# EasyEDA Pro project ProPrj_STM32数字多用表_2024-12-06.epro

# Schematic Schematic1
Board Name: Board1; Create Date: 2024-10-22; Page Name: P1; Project Name: STM32数字多用表; Schematic Name: Schematic1; Update Date: 2024-11-01; Company: 武汉理工大学; Drawed: 廖钟涛、胡广、聂汝琦; Page Size: A4; Version: V1.0
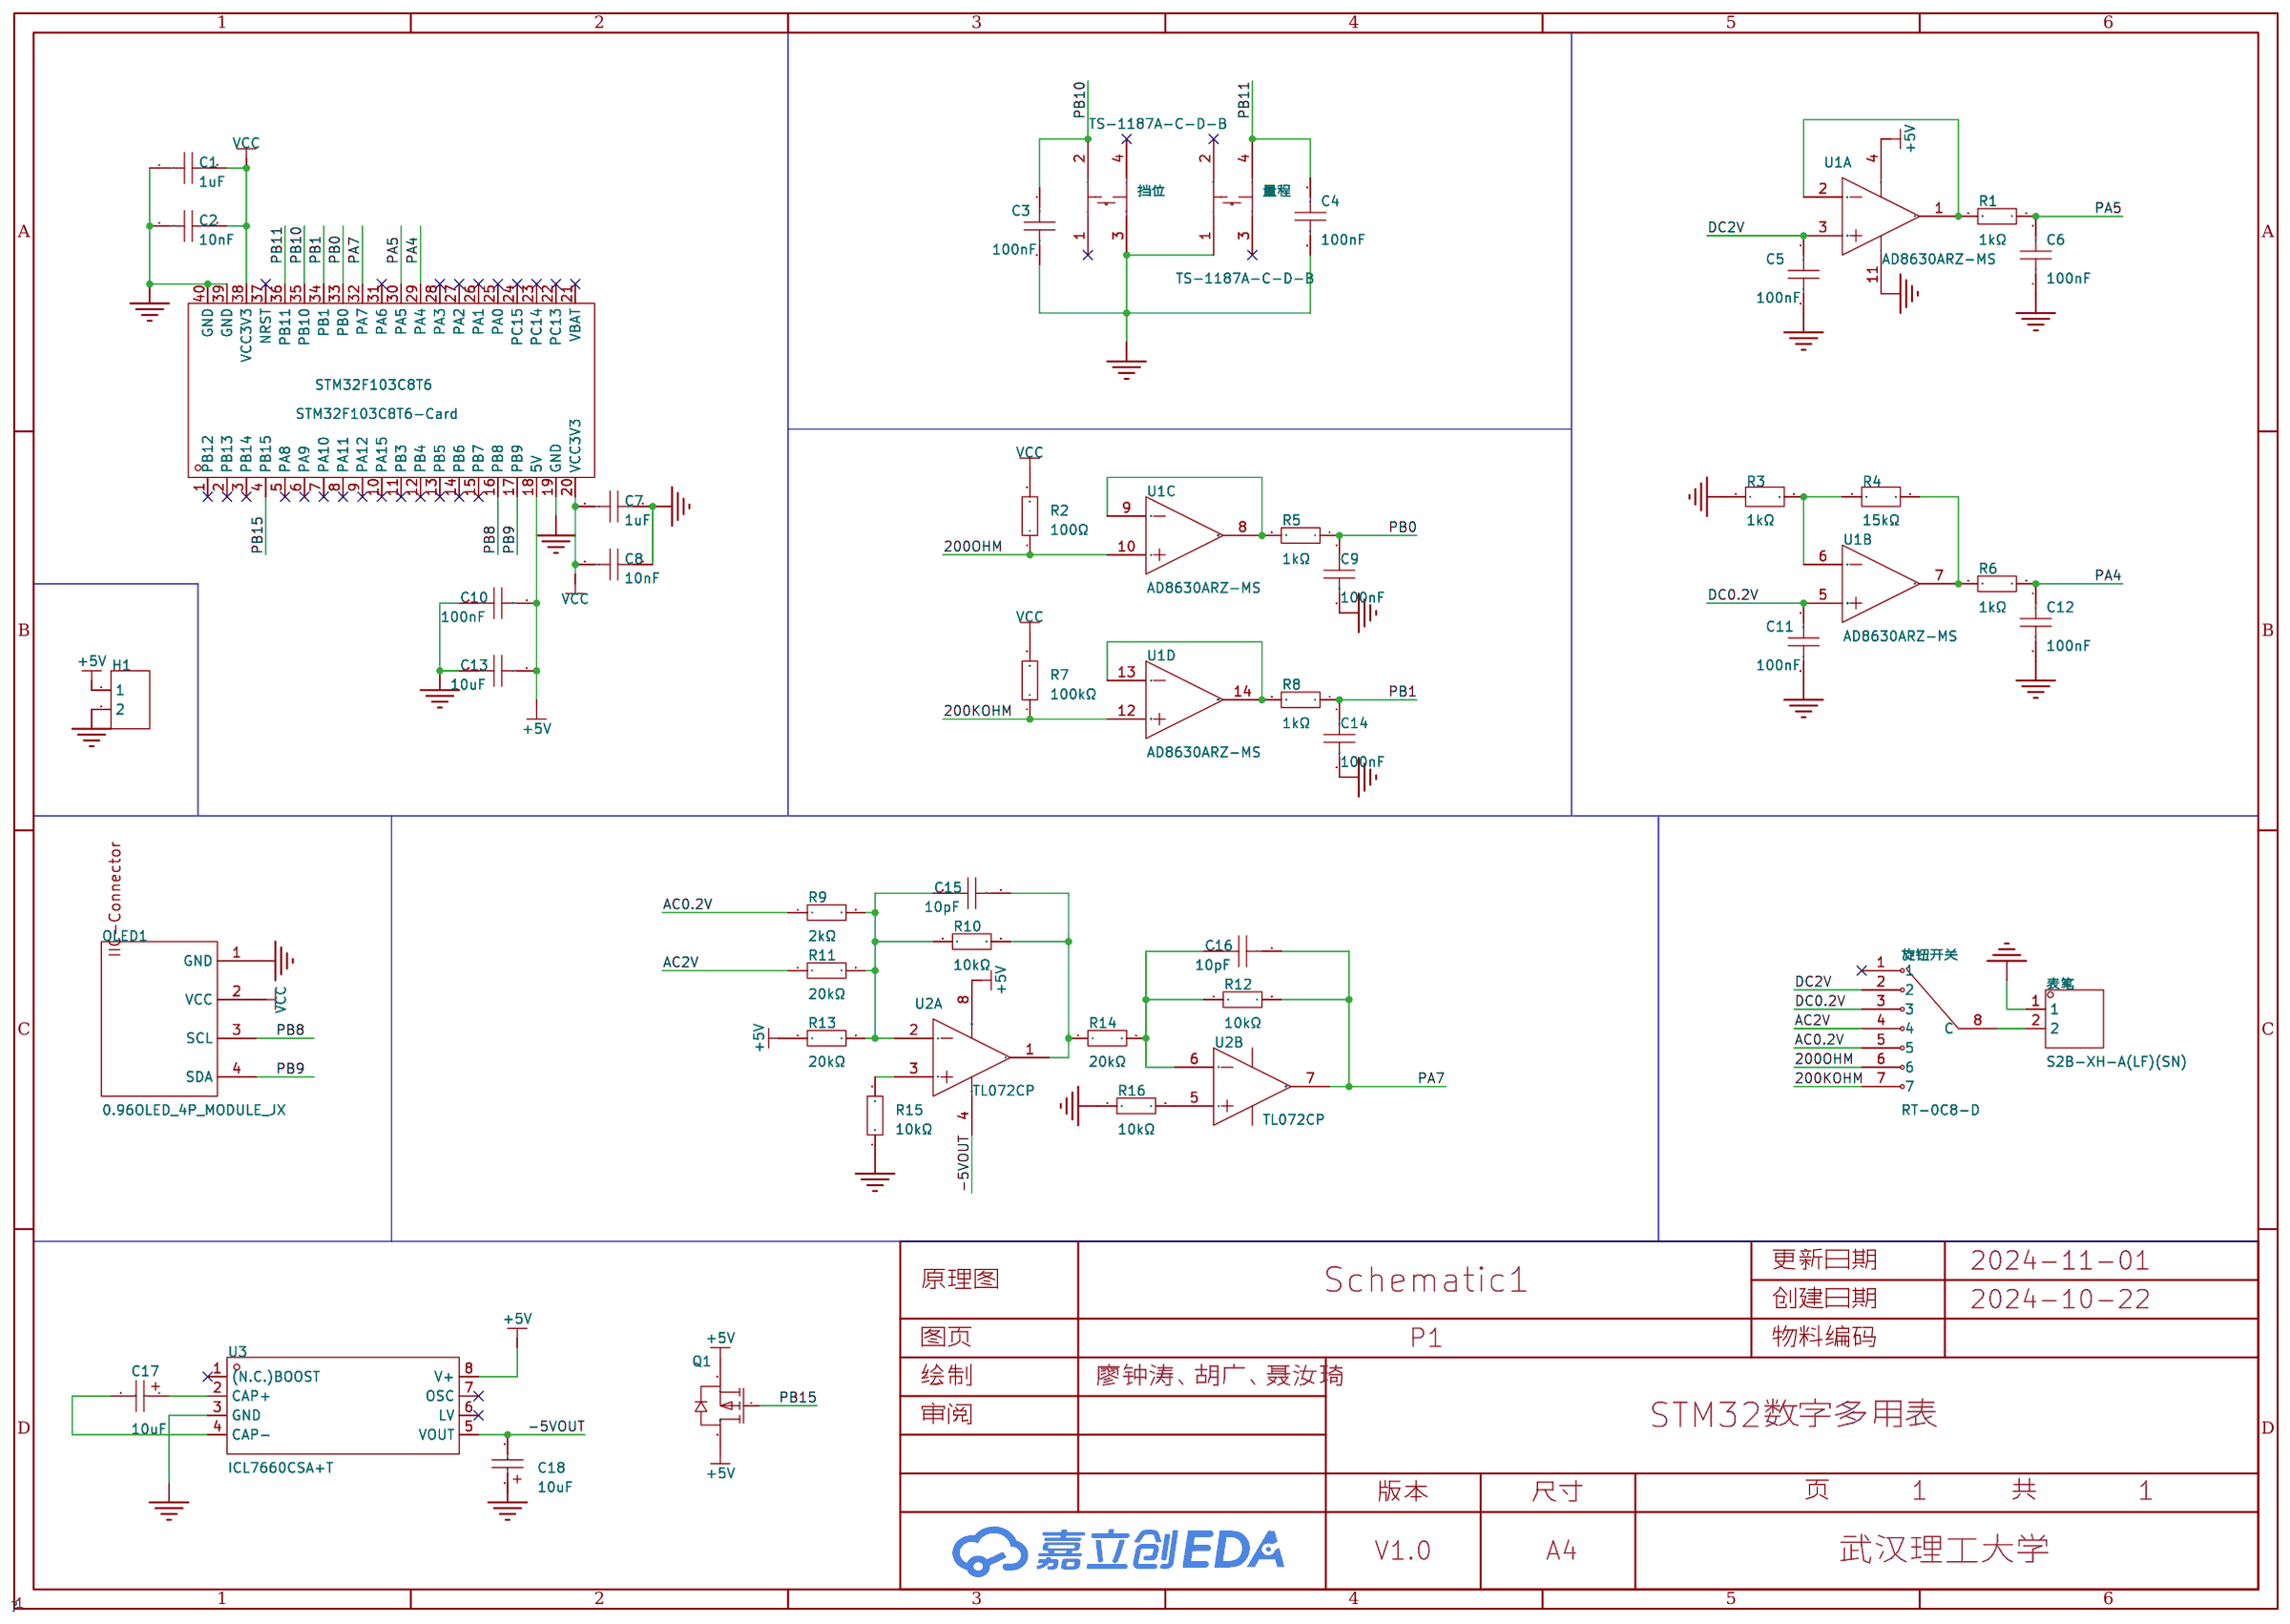
[diagram p0: schematic sheet]

## Parts
C1  1uF  [C0603]
C2  10nF  [C0603]
C3  100nF  [C0603]
C4  100nF  [C0603]
C5  100nF  [C0603]
C6  100nF  [C0603]
C7  1uF  [C0603]
C8  10nF  [C0603]
C9  100nF  [C0603]
C10  100nF  [C0603]
C11  100nF  [C0603]
C12  100nF  [C0603]
C13  10uF  [C0603]
C14  100nF  [C0603]
C15  10pF  [C0603]
C16  10pF  [C0603]
C17  10uF  [CAP-SMD_L3.2-W1.6-RD-C7171]
C18  10uF  [CAP-SMD_L3.2-W1.6-RD-C7171]
H1  -  [HDR-TH_2P-P2.54-V-F]
OLED1  0.96OLED_4P_MODULE_JX  [0.96OLED_4P]
Q1  JMTL3401A  [SOT-23-3_L2.9-W1.3-P1.90-LS2.4-BR]
R1  1kΩ  [R0603]
R2  100Ω  [R0603]
R3  1kΩ  [R0603]
R4  15kΩ  [R0603]
R5  1kΩ  [R0603]
R6  1kΩ  [R0603]
R7  100kΩ  [R0603]
R8  1kΩ  [R0603]
R9  2kΩ  [R0603]
R10  10kΩ  [R0603]
R11  20kΩ  [R0603]
R12  10kΩ  [R0603]
R13  20kΩ  [R0603]
R14  20kΩ  [R0603]
R15  10kΩ  [R0603]
R16  10kΩ  [R0603]
STM32F103C8T6  STM32F103C8T6-Card  [CONN-TH_L53.3-W22.9_STM32F103C8T6-CARD]
U1  AD8630ARZ-MS  [SOIC-14_L8.7-W3.9-P1.27-LS6.0-BL]  (sections 1,2,3,4)
U2  TL072CP  [DIP-8_L9.6-W6.4-P2.54-LS7.6-BL-1]  (sections 1,2)
U3  ICL7660CSA+T  [SO-8_L4.9-W3.9-P1.27-LS5.9-BL]
挡位  TS-1187A-C-D-B  [KEY-SMD_4P-L5.2-W5.2-P3.7-LS6.4-TL]
旋钮开关  RT-0C8-D  [SW-TH_RT-0C4-D]
表笔  S2B-XH-A(LF)(SN)  [CONN-TH_S2B-XH-A-LF-SN]
量程  TS-1187A-C-D-B  [KEY-SMD_4P-L5.2-W5.2-P3.7-LS6.4-TL]

## Library data of the parts
C1 C7 = CGA3E3X5R1E105K080AB: 容值:1uF;精度:±10%;额定电压:25V;材质(温度系数):X5R;; LCSC Part Name: 1uF ±10% 25V; Supplier Part: C2183379; Manufacturer: TDK; Supplier Footprint: 0603; JLCPCB Part Class: 扩展库; Datasheet: https://atta.szlcsc.com/upload/public/pdf/source/20210430/BD8671736ED62E65BA506F30C3AAED50.pdf; Supplier: LCSC; Tolerance: ±10%; Voltage Rated: 25V; Temperature Coefficient: X5R
C2 C8 = CGA3E2X8R2A103K080AE: 容值:10nF;精度:±10%;额定电压:100V;材质(温度系数):X8R;; LCSC Part Name: 10nF ±10% 100V; Supplier Part: C2182499; Manufacturer: TDK; Supplier Footprint: 0603; JLCPCB Part Class: 扩展库; Datasheet: https://atta.szlcsc.com/upload/public/pdf/source/20210430/C200C31AE2B660F751EAC3ACFC19C1F0.pdf; Supplier: LCSC; Tolerance: ±10%; Voltage Rated: 100V; Temperature Coefficient: X8R
C3-C6 C9-C12 C14 = CGA3E2X8R1E104M080AD: 容值:100nF;精度:±20%;额定电压:25V;材质(温度系数):X8R;; LCSC Part Name: 100nF ±20% 25V; Supplier Part: C2177182; Manufacturer: TDK; Supplier Footprint: 0603; JLCPCB Part Class: 扩展库; Datasheet: https://atta.szlcsc.com/upload/public/pdf/source/20210427/4892FA4C59E7E6B03D1B6D7A54E21E17.pdf; Supplier: LCSC; Tolerance: ±20%; Voltage Rated: 25V; Temperature Coefficient: X8R
C13 = CGA3E3X7T0G106M080AB: 容值:10uF;精度:±20%;额定电压:4V;材质(温度系数):X7T;; LCSC Part Name: 10uF ±20% 4V; Supplier Part: C3906091; Manufacturer: TDK; Supplier Footprint: 0603; JLCPCB Part Class: 扩展库; Datasheet: https://atta.szlcsc.com/upload/public/pdf/source/20221212/8CC8E75235799FCBADCCB1AB2750F0E4.pdf; Supplier: LCSC; Tolerance: ±20%; Voltage Rated: 4V; Temperature Coefficient: X7T
C15 C16 = CL10C100JB8NNNC: 容值:10pF;精度:±5%;额定电压:50V;材质(温度系数):C0G;; LCSC Part Name: 10pF ±5% 50V; Supplier Part: C1634; Manufacturer: SAMSUNG(三星); Supplier Footprint: 0603; JLCPCB Part Class: Basic Part; Datasheet: https://atta.szlcsc.com/upload/public/pdf/source/20160218/1457707763339.pdf; Supplier: LCSC; Tolerance: ±5%; Voltage Rated: 50V; Temperature Coefficient: C0G
C17 C18 = TAJA106K016RNJ: 容值:10uF;精度:±10%;额定电压:16V;等效串联电阻:3Ω@100kHz;; LCSC Part Name: 10uF ±10% 16V; Supplier Part: C7171; Manufacturer: Kyocera AVX; Supplier Footprint: CASE-A-3216; JLCPCB Part Class: 基础库; Datasheet: https://atta.szlcsc.com/upload/public/pdf/source/20160107/1457707750344.pdf; Supplier: LCSC; Tolerance: ±10%; Rated Voltage: 16V; Equivalent Series Resistance(ESR): 3Ω@100kHz; Operating Temperature: -55℃~+125℃
H1 = HDR-F_2.54_1x2P: Supplier Part: C49661; Supplier Footprint: 插件
OLED1 = 0.96OLED_4P_MODULE_JX: Supplier Part: C9900004566; Supplier Footprint: 插件; JLCPCB Part Class: 扩展库; Supplier: LCSC
Q1 = JMTL3401A: 类型:P沟道;漏源电压(Vdss):30V;连续漏极电流(Id):4.2A;功率(Pd):1.2W;导通电阻(RDS(on)@Vgs,Id):55mΩ@10V,4.2A;阈值电压(Vgs(th)@Id):1.3V@250A;; LCSC Part Name: P沟道 30V 4.2A; Supplier Part: C394037; Manufacturer: JJW(捷捷微); Supplier Footprint: SOT-23; JLCPCB Part Class: Extended Part; Datasheet: https://atta.szlcsc.com/upload/public/pdf/source/20190520/C394037_1B1F4399ADA96748EB0D3E7B8C1E9AF9.pdf; Supplier: LCSC; Type: P沟道; Drain Source Voltage (Vdss): 30V; Continuous Drain Current (Id): 4.2A; Power Dissipation (Pd): 1.2W; Drain Source On Resistance (RDS(on)@Vgs,Id): 55mΩ@10V,4.2A; Gate Threshold Voltage (Vgs(th)@Id): 1.3V@250A
R1 R5 R6 R8 = 0603WAF1001T5E: 电阻类型:厚膜电阻;阻值:1kΩ;精度:±1%;功率:100mW;最大工作电压:75V;温度系数:±100ppm/℃;; LCSC Part Name: 1kΩ ±1% 100mW 厚膜电阻; Supplier Part: C21190; Manufacturer: UNI-ROYAL(厚声); Supplier Footprint: 0603; JLCPCB Part Class: 基础库; Datasheet: https://atta.szlcsc.com/upload/public/pdf/source/20200306/C422600_1E6D84923E4A46A82E41ADD87F860B5C.pdf; Supplier: LCSC; Type: 厚膜电阻; Tolerance: ±1%; Power(Watts): 100mW; Overload Voltage (Max): 75V; Temperature Coefficient: ±100ppm/℃; Operating Temperature Range: -55℃~+155℃
R2 = RMC06031005%N: 阻值:100Ω;精度:±5%;功率:100mW;; LCSC Part Name: 100Ω ±5% 100mW; Supplier Part: C269683; Manufacturer: Tyohm(幸亚电阻); Supplier Footprint: 0603; JLCPCB Part Class: 扩展库; Datasheet: https://atta.szlcsc.com/upload/public/pdf/source/20190115/C325956_D27151D492FFB3C9AB4A6F14FE01F30A.pdf; Supplier: LCSC; Tolerance: ±5%; Power(Watts): 100mW
R3 = TNPW06031K00BEEA: 电阻类型:薄膜电阻;阻值:1kΩ;精度:±0.1%;功率:125mW;最大工作电压:75V;温度系数:±25ppm/℃;; LCSC Part Name: 薄膜电阻 1kΩ ±0.1% 125mW; Supplier Part: C844891; Manufacturer: VISHAY(威世); Supplier Footprint: 0603; JLCPCB Part Class: 扩展库; Datasheet: https://atta.szlcsc.com/upload/public/pdf/source/20201222/C844891_A262B6C3C739D20D6E453E3A09DCF252.pdf; Supplier: LCSC; Type: 薄膜电阻; Tolerance: ±0.1%; Power(Watts): 125mW; Overload Voltage (Max): 75V; Temperature Coefficient: ±25ppm/℃; Operating Temperature Range: -55℃~+155℃
R4 = CRCW060315K0JNEA: 电阻类型:厚膜电阻;阻值:15kΩ;精度:±5%;功率:100mW;最大工作电压:75V;温度系数:±200ppm/℃;; LCSC Part Name: 厚膜电阻 15kΩ ±5% 100mW; Supplier Part: C844326; Manufacturer: VISHAY(威世); Supplier Footprint: 0603; JLCPCB Part Class: 扩展库; Datasheet: https://atta.szlcsc.com/upload/public/pdf/source/20200922/C242478_0C7172CD6F5C3D507069694ED76193BB.pdf; Supplier: LCSC; Type: 厚膜电阻; Tolerance: ±5%; Power(Watts): 100mW; Overload Voltage (Max): 75V; Temperature Coefficient: ±200ppm/℃; Operating Temperature Range: -55℃~+155℃
R7 = 0603WAF1003T5E: 电阻类型:厚膜电阻;阻值:100kΩ;精度:±1%;功率:100mW;最大工作电压:75V;温度系数:±100ppm/℃;; LCSC Part Name: 100kΩ ±1% 100mW 厚膜电阻; Supplier Part: C25803; Manufacturer: UNI-ROYAL(厚声); Supplier Footprint: 0603; JLCPCB Part Class: Basic Part; Datasheet: https://atta.szlcsc.com/upload/public/pdf/source/20200306/C422600_1E6D84923E4A46A82E41ADD87F860B5C.pdf; Supplier: LCSC; Type: 厚膜电阻; Tolerance: ±1%; Power(Watts): 100mW; Overload Voltage (Max): 75V; Temperature Coefficient: ±100ppm/℃; Operating Temperature Range: -55℃~+155℃
R9 = 0603WAF2001T5E: 电阻类型:厚膜电阻;阻值:2kΩ;精度:±1%;功率:100mW;最大工作电压:75V;温度系数:±100ppm/℃;; LCSC Part Name: 2kΩ ±1% 100mW 厚膜电阻; Supplier Part: C22975; Manufacturer: UNI-ROYAL(厚声); Supplier Footprint: 0603; JLCPCB Part Class: Basic Part; Datasheet: https://atta.szlcsc.com/upload/public/pdf/source/20200306/C422600_1E6D84923E4A46A82E41ADD87F860B5C.pdf; Supplier: LCSC; Type: 厚膜电阻; Tolerance: ±1%; Power(Watts): 100mW; Overload Voltage (Max): 75V; Temperature Coefficient: ±100ppm/℃; Operating Temperature Range: -55℃~+155℃
R10 R12 R15 R16 = 0603WAF1002T5E: 电阻类型:厚膜电阻;阻值:10kΩ;精度:±1%;功率:100mW;最大工作电压:75V;温度系数:±100ppm/℃;; LCSC Part Name: 厚膜电阻 10kΩ ±1% 100mW; Supplier Part: C25804; Manufacturer: UNI-ROYAL(厚声); Supplier Footprint: 0603; JLCPCB Part Class: Basic Part; Datasheet: https://atta.szlcsc.com/upload/public/pdf/source/20200306/C422600_1E6D84923E4A46A82E41ADD87F860B5C.pdf; Supplier: LCSC; Type: 厚膜电阻; Tolerance: ±1%; Power(Watts): 100mW; Overload Voltage (Max): 75V; Temperature Coefficient: ±100ppm/℃; Operating Temperature Range: -55℃~+155℃
R11 R13 R14 = 0603WAF2002T5E: 电阻类型:厚膜电阻;阻值:20kΩ;精度:±1%;功率:100mW;最大工作电压:75V;温度系数:±100ppm/℃;; LCSC Part Name: 20kΩ ±1% 100mW 厚膜电阻; Supplier Part: C4184; Manufacturer: UNI-ROYAL(厚声); Supplier Footprint: 0603; JLCPCB Part Class: Basic Part; Datasheet: https://atta.szlcsc.com/upload/public/pdf/source/20200306/C422600_1E6D84923E4A46A82E41ADD87F860B5C.pdf; Supplier: LCSC; Type: 厚膜电阻; Tolerance: ±1%; Power(Watts): 100mW; Overload Voltage (Max): 75V; Temperature Coefficient: ±100ppm/℃; Operating Temperature Range: -55℃~+155℃
STM32F103C8T6 = STM32F103C8T6-Card: Supplier Part: C9900077949; Supplier Footprint: 插件; Supplier: LCSC
U1 = AD8630ARZ-MS: 此款零漂移四通道运放，采用SOP14封装，他的工作电压2-5.5V,带宽6MHZ,偏移电压0.03µV,输入补偿电压2uV，静态电流600uA,其特点高性能、低功耗的出色表现，能够广泛应用于消费电子产品，音频设备，仪器仪表讯设备以及任何需要精密信号放大的场合，是你的PCB设计最佳选择。; Supplier Part: C22462542; Manufacturer: MSKSEMI(美森科); Supplier Footprint: SOP-14; JLCPCB Part Class: 扩展库; Datasheet: https://atta.szlcsc.com/upload/public/pdf/source/20240618/7B2869656343ADFE631E520B59A27983.pdf; Supplier: LCSC
U2 = TL072CP: 运放类型:J-FET;放大器组数:2;增益带宽积（GBP）:3MHz;压摆率（SR）:13 V/us;电源电压:7V~36V,±3.5V~18V;各通道供电电流:1.4mA;; Supplier Part: C7236; Manufacturer: TI(德州仪器); Supplier Footprint: DIP-8; JLCPCB Part Class: Extended Part; Datasheet: https://atta.szlcsc.com/upload/public/pdf/source/20140704/1457707129967.pdf; Supplier: LCSC; Amplifier Type: J-FET; Number of Circuits: 2; Gain Bandwidth Product（GBP）: 3MHz; Slew Rate（SR）: 13 V/us; Supply Voltage（Single）: 7V~36V,±3.5V~18V; Iq per channel (Typ): 1.4mA; Operating Temperature: 0°C ~ 70°C
U3 = ICL7660CSA+T: 开关电容电压转换器、20mA电荷泵，采用工业标准引脚排列; Supplier Part: C596400; Manufacturer: ADI(亚德诺)/MAXIM(美信); Supplier Footprint: SO-8; JLCPCB Part Class: 扩展库; Datasheet: https://atta.szlcsc.com/upload/public/pdf/source/20191209/C407899_F02514FE12C1148958261B7B463B7B63.pdf; Supplier: LCSC
挡位 量程 = TS-1187A-C-D-B: 电路结构:单刀单掷;按钮形状:圆形按钮;作用力:260gf;安装方式:立贴;开关长度:5.1mm;开关宽度:5.1mm;开关高度:2mm;带支架:不带;触点电流:50mA;额定电压(DC):12V;绝缘电阻:-;带灯:无;机械寿命:10万次;; LCSC Part Name: 5.1*5.1*2mm 立贴 轻触开关; Supplier Part: C318888; Manufacturer: XKB Connectivity(中国星坤); Supplier Footprint: SMD; JLCPCB Part Class: 扩展库; Datasheet: https://atta.szlcsc.com/upload/public/pdf/source/20211011/CF465E46D2427DB66E133733EF19F823.pdf; Supplier: LCSC; Circuit: 单刀单掷; Actuator Style: 圆形按钮; Operating Force: 260gf; Mounting Style: 立贴; Switch Length: 5.1mm; Switch Width: 5.1mm; Switch Height: 2mm; Strike Gundam: 不带; Contact Current: 50mA; Voltage Rating (DC): 12V; Actuator/Cap Color: 金色; With Lamp: 无; Mechanical Life: 10万次; Operating Temperature: -30℃~+85℃
旋钮开关 = RT-0C8-D: 带灯:-;接点数:-;触点类型:-;额定电流:500mA;额定电压(AC):-;额定电压(DC):24V;切换角度:-;层数:-;每层极数:-;; LCSC Part Name: RT系列旋钮开关短柄; Supplier Part: C508444; Manufacturer: Dailywell(德利威); Supplier Footprint: 插件; Datasheet: https://atta.szlcsc.com/upload/public/pdf/source/20200407/C508444_348EF37BAA01A3E81FFFA52EE3C3045F.pdf; Supplier: LCSC; Actuator Type: 扁平型(带槽); Termination Style: PC引脚; Mechanical Life: 2千次; Contact Current: 500mA; Voltage Rating (DC): 24V; Operating Temp: -20℃~+70℃
表笔 = S2B-XH-A(LF)(SN): 插针结构:1x2P;间距:2.5mm;安装方式:弯插;参考系列:XH;总PIN数:2P;排数:1;每排PIN数:2;行距:-;额定电流:3A;触头材质:黄铜;触头镀层:锡;工作温度范围:-25℃~+85℃;; LCSC Part Name: 1x2P 间距:2.5mm 弯插 系列:XH; Supplier Part: C157931; Manufacturer: JST; Supplier Footprint: 弯插,P=2.5mm; JLCPCB Part Class: Extended Part; Datasheet: https://atta.szlcsc.com/upload/public/pdf/source/20180928/C265283_F9DFEEBDB2CF642B6BDFAB4B77BD2680.pdf; Supplier: LCSC; Pins Structure: 1x2P; Pitch: 2.5mm; Mounting Style: 弯插; Reference Series: XH; Number of Pins: 2P; Number of Rows: 1; Number of PINs Per Row: 2; Current Rating (Max): 3A; Contact Material: 黄铜; Contact Plating: 锡; Operating Temperature Range: -25℃~+85℃; Rated Voltage (Max): 250V; Plastic Material: PA66; Flame Retardant Rating: UL94V-0; Supplementary Features: 打K脚; Colour: 白色; Z-Height of the Board: 6.1mm; X-Length of Bottom Edge on Board (Spacing Line): 7.4mm; Y-Width of Bottom Edge on Board: 11.5mm

## Nets
+5V: C10.2 C13.1 H1.1 Q1.2(S) Q1.3(D) R13.1 STM32F103C8T6.18(5V) U1.4(V+) U2.8(VCC+) U3.8(V+)
-5VOUT: C18.2 U2.4(VCC-) U3.5(VOUT)
GND: C1.1 C2.1 C3.2 C4.2 C5.2 C6.1 C7.2 C8.2 C9.2 C10.1 C11.2 C12.2 C13.2 C14.2 C18.1 H1.2 OLED1.1(GND) R3.1 R15.1 R16.1 STM32F103C8T6.19(GND) STM32F103C8T6.39(GND) STM32F103C8T6.40(GND) U1.11(V-) U3.3(GND) 挡位.3 表笔.1 量程.1
VCC: C1.2 C2.2 C7.1 C8.1 OLED1.2(VCC) R2.2 R7.2 STM32F103C8T6.20(VCC3V3) STM32F103C8T6.38(VCC3V3)
200KOHM: R7.1 U1.12(+IN D) 旋钮开关.7
200OHM: R2.1 U1.10(+IN C) 旋钮开关.6
AC0.2V: R9.1 旋钮开关.5
AC2V: R11.1 旋钮开关.4
DC0.2V: C11.1 U1.5(+IN B) 旋钮开关.3
DC2V: C5.1 U1.3(+IN A) 旋钮开关.2
PA4: C12.1 R6.2 STM32F103C8T6.29(PA4)
PA5: C6.2 R1.1 STM32F103C8T6.30(PA5)
PA7: C16.2 R12.2 STM32F103C8T6.32(PA7) U2.7(OUT2)
PB0: C9.1 R5.1 STM32F103C8T6.33(PB0)
PB1: C14.1 R8.1 STM32F103C8T6.34(PB1)
PB8: OLED1.3(SCL) STM32F103C8T6.16(PB8)
PB9: OLED1.4(SDA) STM32F103C8T6.17(PB9)
PB10: C3.1 STM32F103C8T6.35(PB10) 挡位.2
PB11: C4.1 STM32F103C8T6.36(PB11) 量程.4
PB15: Q1.1(G) STM32F103C8T6.4(PB15)
$1N6231: C15.1 R9.2 R10.1 R11.2 R13.2 U2.2(IN1-)
$1N6233: R15.2 U2.3(IN1+)
$1N6489: C15.2 R10.2 R14.1 U2.1(OUT1)
$1N6498: C16.1 R12.1 R14.2 U2.6(IN2-)
$1N25115: R1.2 U1.1(OUTA) U1.2(–IN A)
$1N27258: R16.2 U2.5(IN2+)
$1N27573: R4.2 R6.1 U1.7(OUTB)
$1N27580: R3.2 R4.1 U1.6(–IN B)
$1N27743: R5.2 U1.8(OUTC) U1.9(–IN C)
$1N27788: R8.2 U1.13(–IN D) U1.14(OUTD)
$1N40919: 旋钮开关.8(C) 表笔.2
$1N44928: C17.1 U3.2(CAP+)
$1N44932: C17.2 U3.4(CAP-)

Not connected (* = marked no-connect by the designer): STM32F103C8T6 1(PB12)* 2(PB13)* 3(PB14)* 5(PA8)* 6(PA9)* 7(PA10)* 8(PA11)* 9(PA12)* 10(PA15)* 11(PB3)* 12(PB4)* 13(PB5)* 14(PB6)* 15(PB7)* 21(VBAT)* 22(PC13)* 23(PC14)* 24(PC15)* 25(PA0)* 26(PA1)* 27(PA2)* 28(PA3)* 31(PA6)* 37(NRST)*; U3 1((N.C.)BOOST)* 6(LV)* 7(OSC)*; 挡位 1* 4*; 旋钮开关 1*; 量程 2* 3*

# Board PCB1
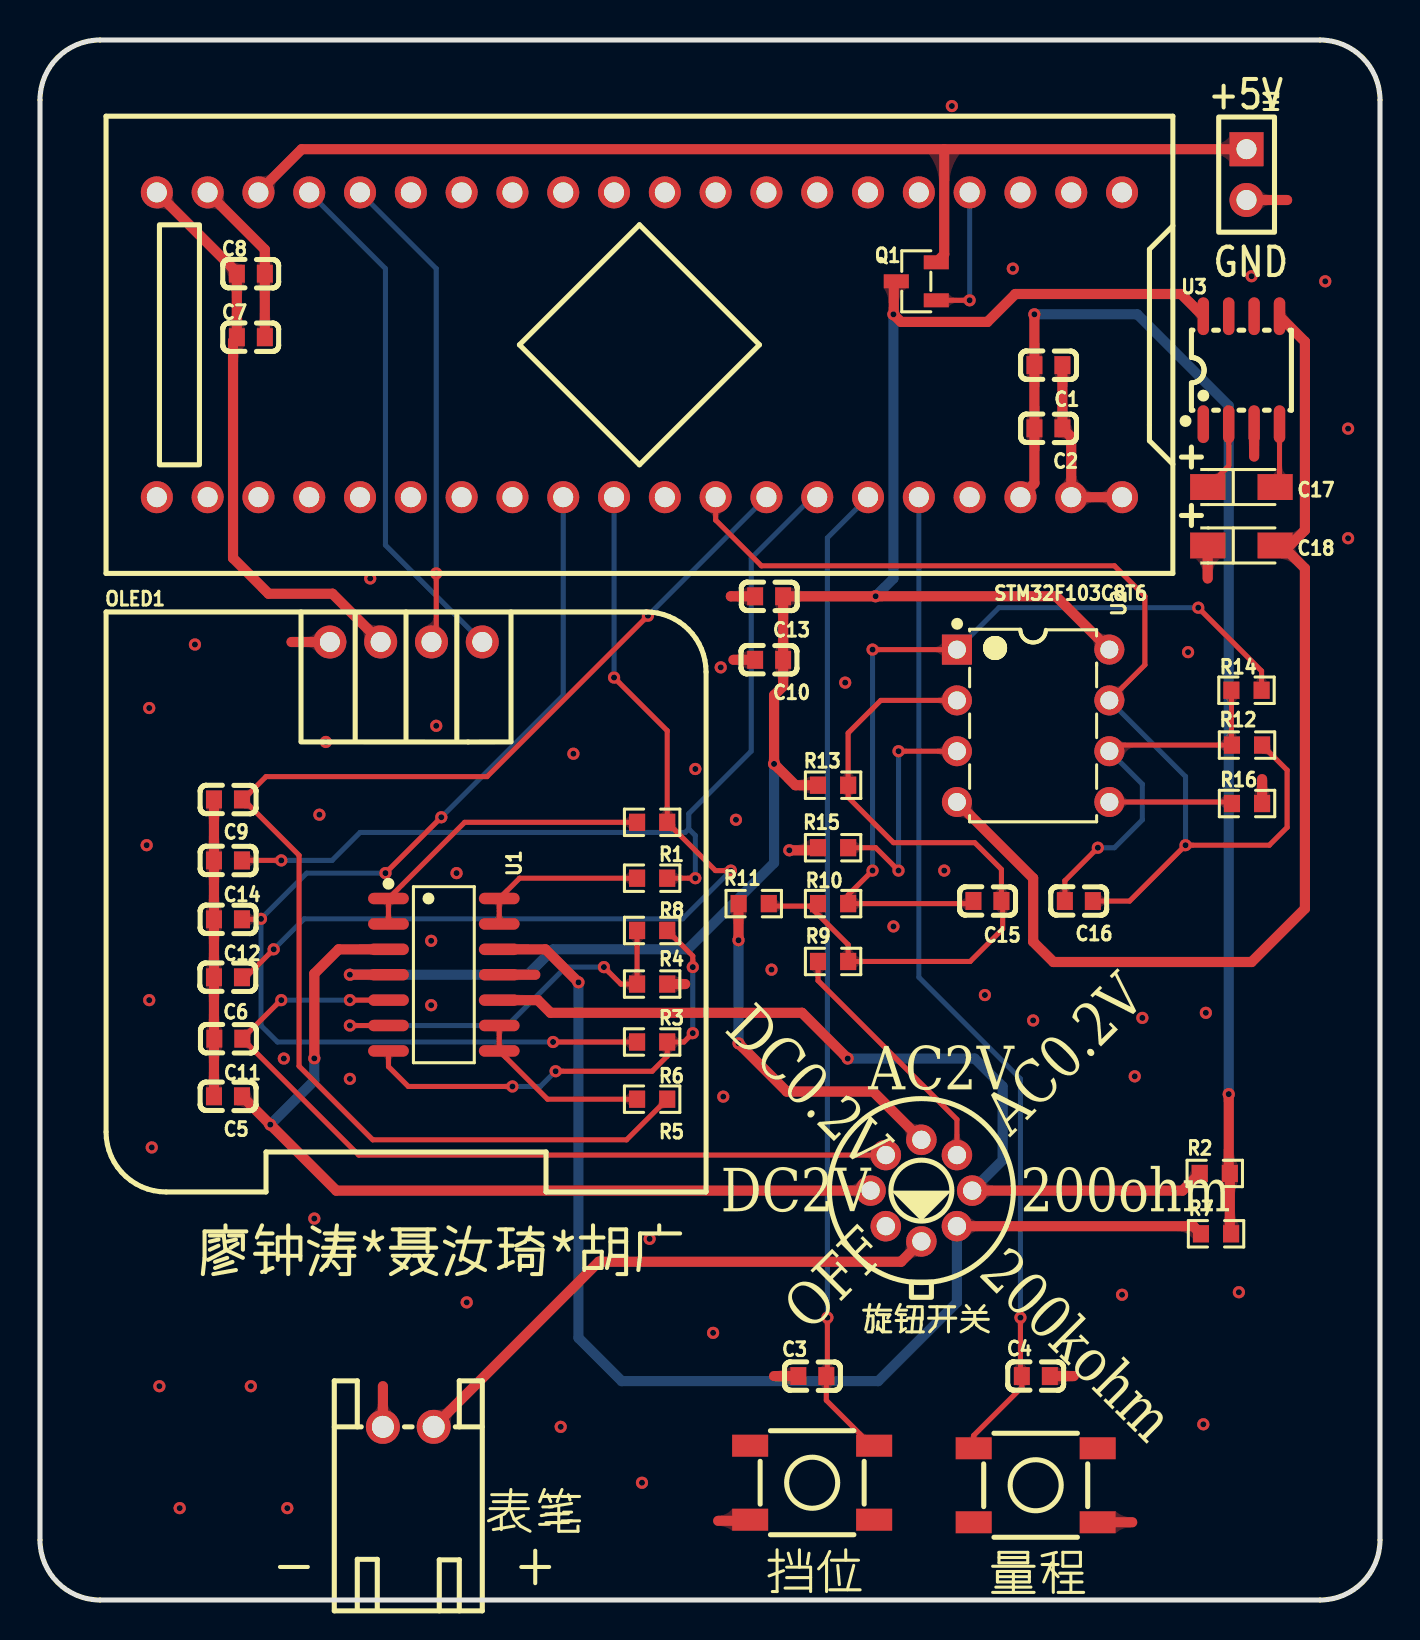
[diagram p1: board, top side]
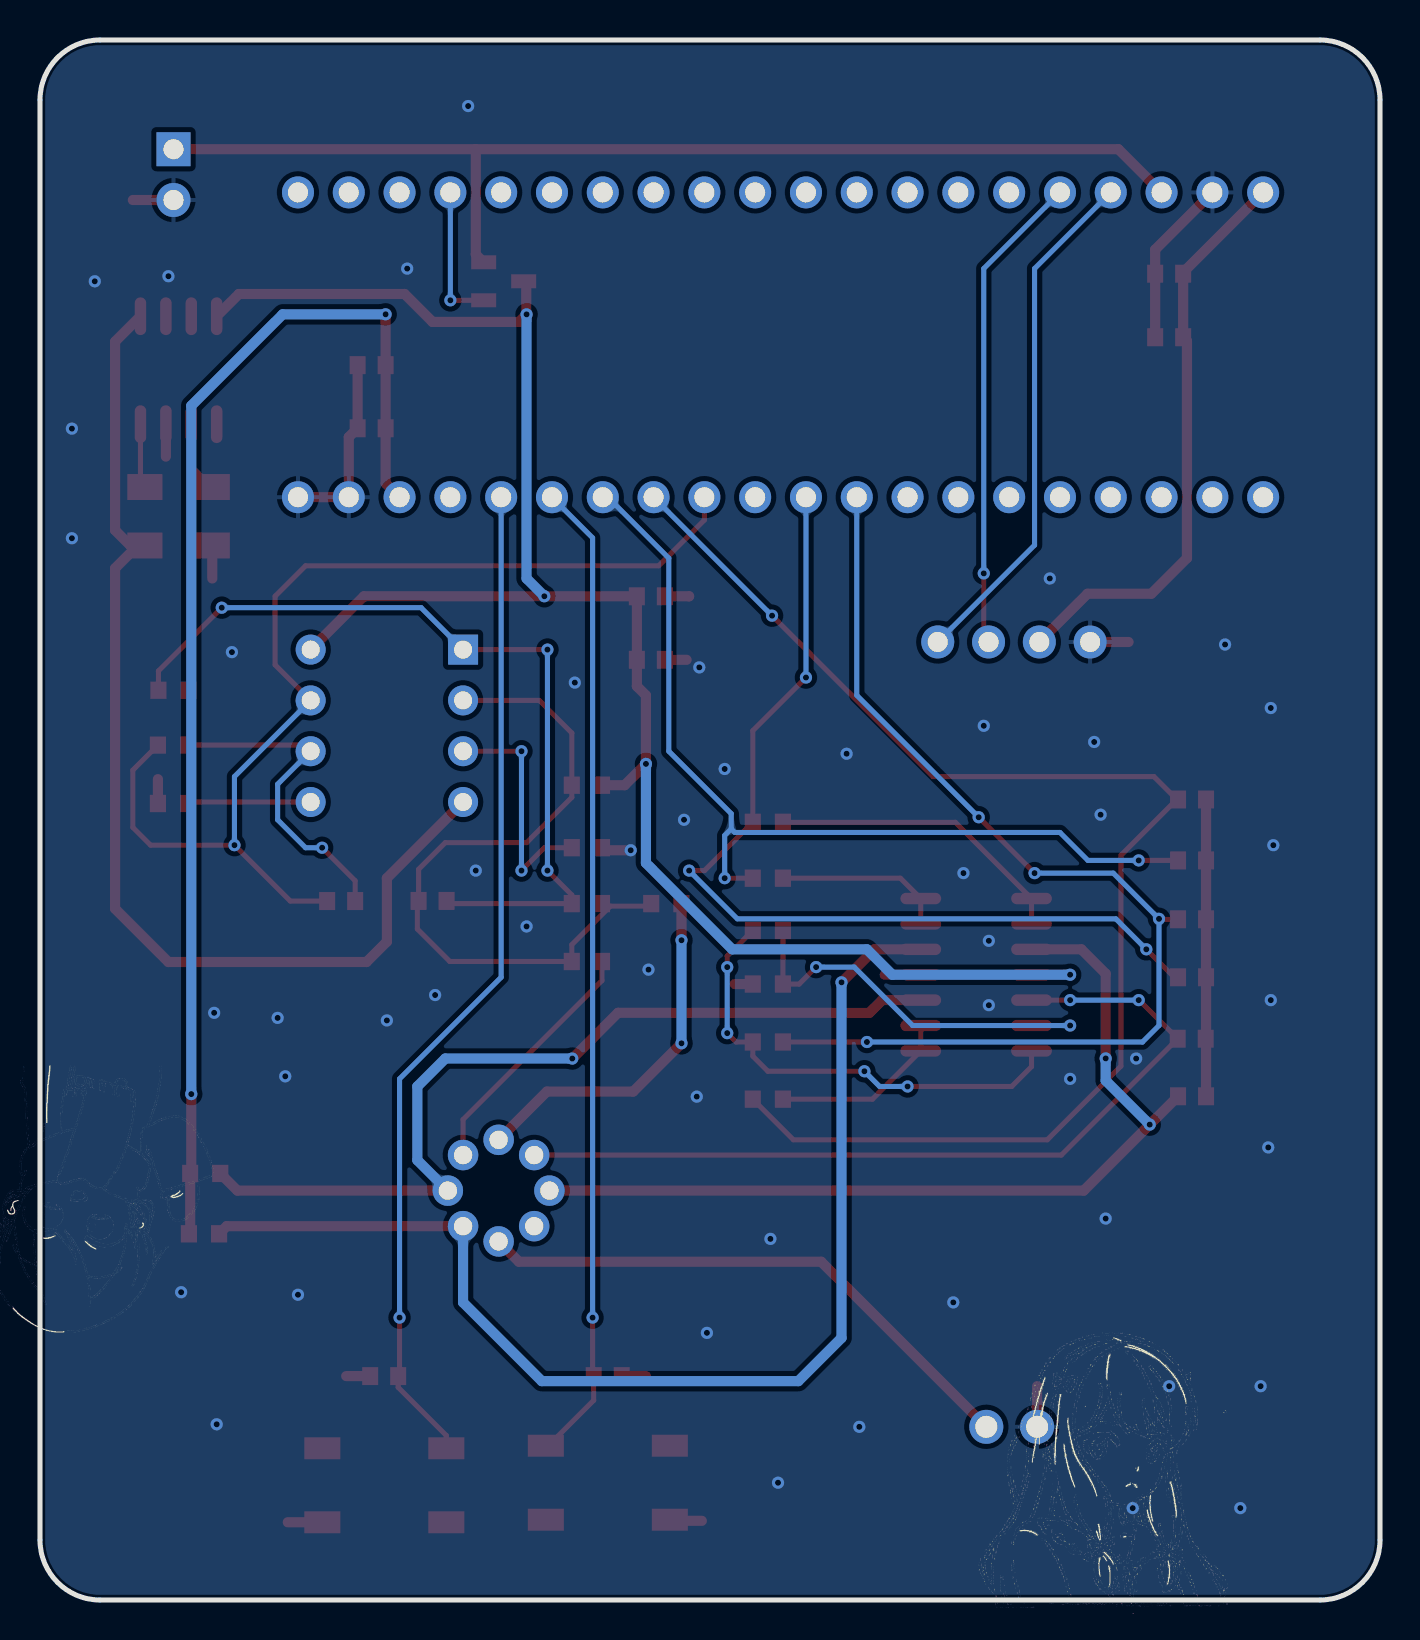
[diagram p2: board, bottom side, seen from below]

Outline 67 x 78 mm; copper layers: Top Layer, Bottom Layer. Coordinates in mm from the lower left corner of the outline.
Outline path: 0,75 0,3 arc(0.88,0.88) 3,0 64,0 arc(66.12,0.88) 67,3 67,75 arc(66.12,77.12) 64,78 3,78 arc(0.88,77.12) 0,75
Stack: Top Layer 0.035mm / Dielectric1 1.51mm FR4 er 4.5 / Bottom Layer 0.035mm

## Design rules (mm)
net GND: power
net VCC: power
net +5V: power
net AC2V: power
net 200KOHM: power
net DC2V: power
net -5VOUT: power
template: 自定义配置
spacing copperThickness1oz (default): track to track 0.203, other pairs 0.203 to 0.203
spacing copperThickness2oz: track to track 0.203, other pairs 0.152 to 0.3
track width copperThickness1oz (default): min 0.152, default 0.254, max 0.508
track width copperThickness2oz: min 0.203, default 0.254, max 2.54
track width power: min 0.305, default 0.508, max 2.54
differential pair differentialPair (default): width min 0.152, default 0.152, max 0.152; gap min 0.152, default 0.152
via viaSize (default): diameter min 0.61, default 0.61, max 0.61; hole min 0.305, default 0.305, max 0.305
net class power uses power
net GND uses power
net VCC uses power
net +5V uses power
net AC2V uses power
net 200KOHM uses power
net DC2V uses power
net 200OHM uses power
net -5VOUT uses power

## Placement (name value [footprint] x y rotation side)
C1  1uF  [C0603]  50.42 61.74 180 top
C2  10nF  [C0603]  50.42 58.59 180 top
C3  100nF  [C0603]  38.62 11.2 180 top
C4  100nF  [C0603]  49.79 11.2 0 top
C5  100nF  [C0603]  9.4 25.19 180 top
C6  100nF  [C0603]  9.4 31.14 0 top
C7  1uF  [C0603]  10.54 63.14 0 top
C8  10nF  [C0603]  10.54 66.31 0 top
C9  100nF  [C0603]  9.4 40.03 180 top
C10  100nF  [C0603]  36.46 47.01 0 top
C11  100nF  [C0603]  9.41 28.07 180 top
C12  100nF  [C0603]  9.4 34.03 180 top
C13  10uF  [C0603]  36.46 50.18 180 top
C14  100nF  [C0603]  9.4 36.98 180 top
C15  10pF  [C0603]  47.37 34.95 180 top
C16  10pF  [C0603]  51.94 34.95 0 top
C17  10uF  [CAP-SMD_L3.2-W1.6-RD-C7171]  60.07 55.65 0 top
C18  10uF  [CAP-SMD_L3.2-W1.6-RD-C7171]  60.07 52.73 0 top
H1  -  [HDR-TH_2P-P2.54-V-F]  60.32 71.27 270 top
OLED1  0.96OLED_4P_MODULE_JX  [0.96OLED_4P]  18.3 47.9 0 top
Q1  JMTL3401A  [SOT-23-3_L2.9-W1.3-P1.90-LS2.4-BR]  43.81 65.94 0 top
R1  1kΩ  [R0603]  30.61 38.88 180 top
R2  100Ω  [R0603]  58.74 21.33 0 top
R3  1kΩ  [R0603]  30.61 30.8 180 top
R4  15kΩ  [R0603]  30.61 33.48 0 top
R5  1kΩ  [R0603]  30.61 25.04 180 top
R6  1kΩ  [R0603]  30.61 27.9 180 top
R7  100kΩ  [R0603]  58.8 18.31 0 top
R8  1kΩ  [R0603]  30.61 36.09 180 top
R9  2kΩ  [R0603]  39.65 31.93 0 top
R10  10kΩ  [R0603]  39.65 34.82 0 top
R11  20kΩ  [R0603]  35.69 34.82 0 top
R12  10kΩ  [R0603]  60.35 42.75 0 top
R13  20kΩ  [R0603]  39.65 40.74 0 top
R14  20kΩ  [R0603]  60.32 45.49 180 top
R15  10kΩ  [R0603]  39.65 37.61 0 top
R16  10kΩ  [R0603]  60.35 39.82 180 top
STM32F103C8T6  STM32F103C8T6-Card  [CONN-TH_L53.3-W22.9_STM32F103C8T6-CARD]  29.97 62.76 180 top
U1  AD8630ARZ-MS  [SOIC-14_L8.7-W3.9-P1.27-LS6.0-BL]  20.19 31.26 270 top
U2  TL072CP  [DIP-8_L9.6-W6.4-P2.54-LS7.6-BL-1]  49.66 43.71 270 top
U3  ICL7660CSA+T  [SO-8_L4.9-W3.9-P1.27-LS5.9-BL]  60.07 61.49 0 top
挡位  TS-1187A-C-D-B  [KEY-SMD_4P-L5.2-W5.2-P3.7-LS6.4-TL]  38.61 5.86 0 top
旋钮开关  RT-0C8-D  [SW-TH_RT-0C4-D]  44.07 20.47 180 top
表笔  S2B-XH-A(LF)(SN)  [CONN-TH_S2B-XH-A-LF-SN]  18.41 8.66 180 top
量程  TS-1187A-C-D-B  [KEY-SMD_4P-L5.2-W5.2-P3.7-LS6.4-TL]  49.78 5.74 180 top

## Footprints (pads in the part's own frame, mm; a bottom-side part is the same pattern mirrored in y, then rotated)
0.96OLED_4P
  round 1.65 hole 1: 1(-3.81,-0.002) 2(-1.27,0.002) 3(1.27,0.002) 4(3.81,0.002)
C0603
  rect 0.8x0.9 smd: 1(-0.7,0) 2(0.7,0)
CAP-SMD_L3.2-W1.6-RD-C7171
  rect 1.758x1.296 smd: 1(-1.687,0) 2(1.687,0)
CONN-TH_L53.3-W22.9_STM32F103C8T6-CARD
  round 1.6 hole 1: 1(-24.13,-7.62) 2(-21.59,-7.62) 3(-19.05,-7.62) 4(-16.51,-7.62) 5(-13.97,-7.62) 6(-11.43,-7.62) 7(-8.89,-7.62) 8(-6.35,-7.62) 9(-3.81,-7.62) 10(-1.27,-7.62) 11(1.27,-7.62) 12(3.81,-7.62) 13(6.35,-7.62) 14(8.89,-7.62) 15(11.43,-7.62) 16(13.97,-7.62) 17(16.51,-7.62) 18(19.05,-7.62) 19(21.59,-7.62) 20(24.13,-7.62) 21(24.13,7.62) 22(21.59,7.62) 23(19.05,7.62) 24(16.51,7.62) 25(13.97,7.62) 26(11.43,7.62) 27(8.89,7.62) 28(6.35,7.62) 29(3.81,7.62) 30(1.27,7.62) 31(-1.27,7.62) 32(-3.81,7.62) 33(-6.35,7.62) 34(-8.89,7.62) 35(-11.43,7.62) 36(-13.97,7.62) 37(-16.51,7.62) 38(-19.05,7.62) 39(-21.59,7.62) 40(-24.13,7.62)
CONN-TH_S2B-XH-A-LF-SN
  round 1.7 hole 1.1: 1(1.27,0) 2(-1.27,0)
DIP-8_L9.6-W6.4-P2.54-LS7.6-BL-1
  rect 1.501x1.501 hole 0.899: 1(-3.81,-3.81)
  round 1.501 hole 0.899: 2(-1.27,-3.81) 3(1.27,-3.81) 4(3.81,-3.81) 5(3.81,3.81) 6(1.27,3.81) 7(-1.27,3.81) 8(-3.81,3.81)
HDR-TH_2P-P2.54-V-F
  rect 1.7x1.7 hole 1: 1(-1.27,0)
  round 1.7 hole 1: 2(1.27,0)
KEY-SMD_4P-L5.2-W5.2-P3.7-LS6.4-TL
  rect 1.8x1.1 smd: 1(-3.1,1.85) 2(3.1,1.85) 3(-3.1,-1.85) 4(3.1,-1.85)
R0603
  rect 0.806x0.864 smd: 1(-0.753,0) 2(0.753,0)
SO-8_L4.9-W3.9-P1.27-LS5.9-BL
  oval 0.574x1.888 smd: 1(-1.905,-2.699) 2(-0.635,-2.699) 3(0.635,-2.699) 4(1.905,-2.699) 5(1.905,2.699) 6(0.635,2.699) 7(-0.635,2.699) 8(-1.905,2.699)
SOIC-14_L8.7-W3.9-P1.27-LS6.0-BL
  oval 0.574x2.038 smd: 1(-3.81,-2.769) 2(-2.54,-2.769) 3(-1.27,-2.769) 4(0,-2.769) 5(1.27,-2.769) 6(2.54,-2.769) 7(3.81,-2.769) 8(3.81,2.769) 9(2.54,2.769) 10(1.27,2.769) 11(0,2.769) 12(-1.27,2.769) 13(-2.54,2.769) 14(-3.81,2.769)
SOT-23-3_L2.9-W1.3-P1.90-LS2.4-BR
  rect 1.25x0.7 smd: 1(1,-0.95) 2(1,0.95) 3(-1,0)
SW-TH_RT-0C4-D
  round 1.524 hole 0.914: 1(1.778,1.778) 2(2.54,0) 3(1.778,-1.778) 4(0,-2.54) 5(-1.778,-1.778) 6(-2.54,0) 7(-1.778,1.778) 8(0,2.54)

## Nets
As in the schematic.

Pads without a net: STM32F103C8T6 1 2 3 5 6 7 8 9 10 11 12 13 14 15 21 22 23 24 25 26 27 28 31 37; U3 1 6 7; 挡位 1 4; 旋钮开关 1; 量程 2 3

## Via types
v1: diameter 0.61, hole 0.305, Top Layer to Bottom Layer, 90 vias

## Routing (per net, layer and track width the routed paths; a pad name or vN(x,y) marks a point on that pad's centre or on a via; arc(x,y) is an arc through that point)
+5V: length 148
  Top Layer w0.508: U3.8 57.06,65.3 48.77,65.3 47.37,63.9 43.05,63.9 v1(42.67,64.28) 42.69,64.3 42.69,65.94 ; U1.4 v1(15.49,31.26) ; H1.1 45.21,72.54 ; 45.21,72.54 45.21,67.28 Q1.2 ; 45.21,72.54 13.08,72.54 STM32F103C8T6.18 ; 38.9,40.74 37.77,40.74 v1(36.7,41.81) 36.7,45.23 37.16,45.69 C10.2 C13.1 41.78,50.18 v1(41.78,50.19) 50.8,50.19 U2.8
  Bottom Layer w0.508: v1(41.78,50.19) 42.67,51.08 v1(42.67,64.28) ; v1(36.7,41.81) 36.7,36.85 32.38,32.53 25.65,32.53 24.38,31.26 v1(15.49,31.26)
-5VOUT: length 55.3
  Top Layer w0.508: 62.1,52.73 C18.2 ; 62.1,52.73 62.48,52.73 63.25,53.49 63.25,62.92 U3.5 ; 62.1,52.73 63.25,51.58 63.25,34.57 60.58,31.9 50.67,31.9 49.66,32.92 49.66,36.09 U2.4
GND: length 55.3
  Top Layer w0.508: 表笔.1 17.14,10.69 ; C4.2 51.69,11.2 ; C3.2 36.7,11.2 ; R3.1 32.26,30.8 ; STM32F103C8T6.40 STM32F103C8T6.39 51.56,58.14 C2.1 C1.1 ; R16.1 61.1,41.04 ; 量程.1 54.61,3.89 ; C7.2 C8.2 11.24,67.52 STM32F103C8T6.19 ; U3.3 60.71,57.17 ; C10.1 34.67,47.01 ; C5.2 C6.1 C12.2 C14.2 C9.2 ; v1(37.47,37.49) 38.77,37.49 38.9,37.61 ; OLED1.1 12.57,47.9 ; 34.54,50.19 34.55,50.18 C13.2 ; U1.11 24.76,31.26 ; C18.1 58.38,51.08 ; 挡位.3 35.45,3.96 33.91,3.96 ; H1.2 62.36,70
  vias: v1(5.33,37.74) v1(5.46,44.6) v1(5.46,29.99) v1(5.59,22.63) v1(5.97,10.69) v1(6.98,4.59) v1(7.75,47.77) v1(10.54,10.69) v1(12.19,27.07) v1(12.36,4.59) v1(13.72,19.07) v1(13.97,39.27) v1(14.29,42.9) v1(15.49,26.06) v1(16.51,51.08) v1(19.56,32.96) v1(19.56,29.74) v1(19.81,43.71) v1(20.83,36.34) v1(21.34,14.88) v1(26.03,8.66) v1(26.67,42.31) v1(30.1,5.86) v1(30.48,18.06) v1(32.77,41.55) v1(33.66,13.36) v1(34.04,46.63) v1(34.16,25.17) v1(34.8,39.01) v1(36.58,31.52) v1(40.26,45.87) v1(42.67,33.68) v1(45.21,36.47) v1(45.59,74.7) v1(47.24,30.25) v1(48.64,66.57) v1(49.66,28.98) v1(54.1,15.26) v1(54.74,26.18) v1(55.12,29.11) v1(57.4,47.39) v1(58.17,8.78) v1(58.29,29.36) v1(59.94,15.39) v1(60.58,66.19) v1(64.26,65.94) v1(65.41,58.57) v1(65.41,53.09)
VCC: length 91.6
  Top Layer w0.508: v1(49.72,64.28) C1.2 C2.2 49.72,55.84 STM32F103C8T6.38 ; OLED1.2 14.62,50.31 11.43,50.31 9.65,52.09 9.65,62.95 C7.1 C8.1 9.84,66.38 STM32F103C8T6.20 ; R7.2 59.49,18.37 R2.2 ; v1(59.44,25.3) 59.44,21.38
  Bottom Layer w0.508: v1(49.72,64.28) 54.86,64.28 59.44,59.71 v1(59.44,25.3)
200KOHM: length 60
  Top Layer w0.508: 45.85,18.69 57.67,18.69 R7.1 ; v1(26.92,30.88) 25.27,32.53 U1.12
  Bottom Layer w0.508: v1(26.92,30.88) 26.92,13.1 29.08,10.94 41.91,10.94 45.85,14.88 45.85,18.69
200OHM: length 44.5
  Top Layer w0.508: U1.10 24.89,29.99 25.53,29.36 38.1,29.36 v1(40.39,27.07) ; 旋钮开关.6 57.13,20.47 R2.1
  Bottom Layer w0.508: v1(40.39,27.07) 46.74,27.07 48.13,25.68 48.13,21.99 旋钮开关.6
AC0.2V: length 12.6
  Top Layer w0.254: 38.9,31.93 38.9,30.97 45.85,24.03 45.85,22.25
AC2V: length 17.9
  Top Layer w0.508: R11.1 34.93,34.81 v1(34.93,32.99) ; v1(34.93,27.83) 37.34,25.42 41.66,25.42 旋钮开关.4
  Bottom Layer w0.508: v1(34.93,27.83) 34.93,32.79
DC0.2V: length 42.7
  Top Layer w0.254: v1(12.06,29.99) 12.04,29.99 C11.1 15.93,22.25 旋钮开关.3 ; v1(15.49,29.99) U1.5
  Bottom Layer w0.254: v1(12.06,29.99) v1(15.49,29.99)
DC2V: length 46.1
  Top Layer w0.508: v1(13.72,27.08) 13.72,31.32 14.93,32.53 U1.3 ; C5.1 v1(11.51,23.77) 14.81,20.47 旋钮开关.2
  Bottom Layer w0.508: v1(13.72,27.08) 13.72,25.97 v1(11.51,23.77)
PA4: length 55.1
  Top Layer w0.254: v1(25.65,27.9) R6.2 ; C12.1 11.03,34.03 v1(11.05,34.06) ; v1(17.27,36.34) v1(20.07,39.14)
  Bottom Layer w0.254: v1(20.07,39.14) 26.16,45.23 STM32F103C8T6.29 ; v1(25.65,27.9) 11.87,27.9 11.05,28.72 v1(11.05,34.06) 13.33,36.34 v1(17.27,36.34)
PA5: length 48.2
  Top Layer w0.254: v1(28.7,46.12) 31.36,43.46 R1.1 33.77,36.47 v1(34.54,36.47) ; C6.2 10.29,31.14 v1(11.68,32.53)
  Bottom Layer w0.254: v1(34.54,36.47) 32.13,34.06 13.21,34.06 v1(11.68,32.53) ; v1(28.7,46.12) STM32F103C8T6.30
PA7: length 54.8
  Top Layer w0.254: R12.2 62.36,41.49 62.36,38.63 61.47,37.74 v1(57.28,37.74) 54.48,34.95 C16.2 ; U2.7 55.25,46.76 55.25,50.19 53.72,51.71 36.07,51.71 33.78,54 STM32F103C8T6.32
  Bottom Layer w0.254: U2.7 57.28,41.17 v1(57.28,37.74)
PB0: length 67.8
  Top Layer w0.254: R5.1 29.33,23.01 16.64,23.01 12.95,26.69 12.95,37.23 10.16,40.03 ; 10.16,40.03 11.3,41.17 22.35,41.17 v1(30.4,49.22) ; 10.16,40.03 C9.1
  Bottom Layer w0.254: v1(30.4,49.22) STM32F103C8T6.33
PB1: length 46.4
  Top Layer w0.254: R8.1 v1(32.77,36.09) ; v1(12.06,36.98) C14.1
  Bottom Layer w0.254: 32.44,38.56 32.77,38.23 v1(32.77,36.09) ; 32.44,38.56 32.26,38.38 16,38.38 14.61,36.98 v1(12.06,36.98) ; 32.44,38.56 32.44,39.32 35.56,42.44 35.56,52.09 38.61,55.14 STM32F103C8T6.34
PB8: length 24.2
  Top Layer w0.254: v1(19.81,51.33) 19.81,48.14 OLED1.3
  Bottom Layer w0.254: STM32F103C8T6.16 19.81,66.57 v1(19.81,51.33)
PB9: length 26.1
  Bottom Layer w0.254: OLED1.4 17.27,52.74 17.27,66.57 STM32F103C8T6.17
PB10: length 49.4
  Top Layer w0.254: v1(39.37,14.12) 39.37,11.25 C3.1 39.32,9.98 41.58,7.71 挡位.2
  Bottom Layer w0.254: STM32F103C8T6.35 39.37,53.11 v1(39.37,14.12)
PB11: length 50.7
  Top Layer w0.254: v1(49.02,14.12) 49.02,11.26 C4.1 49.09,10.63 46.68,8.22 量程.4
  Bottom Layer w0.254: STM32F103C8T6.36 43.94,31.14 49.02,26.06 v1(49.02,14.12)
PB15: length 7.1
  Top Layer w0.254: Q1.1 v1(46.48,64.98)
  Bottom Layer w0.254: v1(46.48,64.98) STM32F103C8T6.4
$1N6231: length 35.6
  Top Layer w0.254: R11.2 36.57,34.69 38.48,34.69 40.41,32.77 R9.2 46.51,31.93 48.13,33.55 48.13,34.89 C15.1 48.07,36.53 46.74,37.87 42.67,37.87 40.41,40.13 R13.2 40.41,43.35 42.04,44.98 U2.2
$1N6233: length 11.9
  Top Layer w0.254: v1(42.93,42.44) U2.3 ; R15.2 41.78,37.61 v1(42.93,36.47)
  Bottom Layer w0.254: v1(42.93,36.47) v1(42.93,42.44)
$1N6489: length 42.1
  Top Layer w0.254: v1(57.91,49.62) 61.08,46.45 R14.1 ; C15.2 46.54,34.82 R10.2 40.41,35.25 v1(41.63,36.47) ; U2.1 v1(41.63,47.52)
  Bottom Layer w0.254: U2.1 47.94,49.62 v1(57.91,49.62) ; v1(41.63,47.52) v1(41.63,36.47)
$1N6498: length 19.3
  Top Layer w0.254: R14.2 59.57,42.77 R12.1 53.77,42.75 U2.6 ; v1(52.89,37.61) 51.24,35.96 C16.1
  Bottom Layer w0.254: v1(52.89,37.61) 53.72,37.61 55.12,39.01 55.12,40.79 U2.6
$1N25115: length 15.3
  Top Layer w0.254: U1.2 U1.1 21.23,38.88 R1.2
$1N27258: length 6.2
  Top Layer w0.254: U2.5 59.52,39.9 R16.2
$1N27573: length 23.6
  Top Layer w0.254: v1(23.62,25.68) 18.41,25.68 17.42,26.67 U1.7 ; R4.2 32.64,32.2 v1(32.64,31.64) ; v1(32.64,28.34) 32.2,27.9 R6.1 31.36,27.19 30.61,26.44 v1(25.78,26.44)
  Bottom Layer w0.254: v1(25.78,26.44) 25.02,25.68 v1(23.62,25.68) ; v1(32.64,28.34) v1(32.64,31.64)
$1N27580: length 20.5
  Top Layer w0.254: U1.6 v1(15.49,28.72) ; R4.1 R3.2 29.04,30.8 v1(28.19,31.64)
  Bottom Layer w0.254: v1(15.49,28.72) 23.37,28.72 26.29,31.64 v1(28.19,31.64)
$1N27743: length 9.2
  Top Layer w0.254: U1.9 U1.8 25.38,25.04 R5.2
$1N27788: length 8.6
  Top Layer w0.254: U1.13 U1.14 23.98,36.09 R8.2
$1N40919: length 28.2
  Top Layer w0.508: 旋钮开关.8 43.05,16.91 27.94,16.91 表笔.2
$1N44928: length 3.6
  Top Layer w0.254: U3.2 59.44,56.7 C17.1
$1N44932: length 3.2
  Top Layer w0.254: U3.4 61.98,55.87 C17.2

## Copper pours and planes (outline as drawn; the poured copper is in the pictures)
GND on Top Layer: -4.83,82.06 70.23,82.06 70.23,-3.41 -4.83,-3.41
GND on Bottom Layer: -4.95,82.06 70.1,82.06 70.1,-3.41 -4.95,-3.41

Small or netless copper shapes (teardrops, artwork), in the pictures only: 200 on Top Layer, 57 on Bottom Layer

## Text on the board
Top Silkscreen Layer: +5V | GND | - | + | DC0.2V | 200kohm | 廖钟涛*聂汝琦*胡广 | DC2V | AC2V | 200ohm | OFF | AC0.2V
